# Altium schematic sheet [06]-DDR2_INTERFACE.SchDoc
size A4
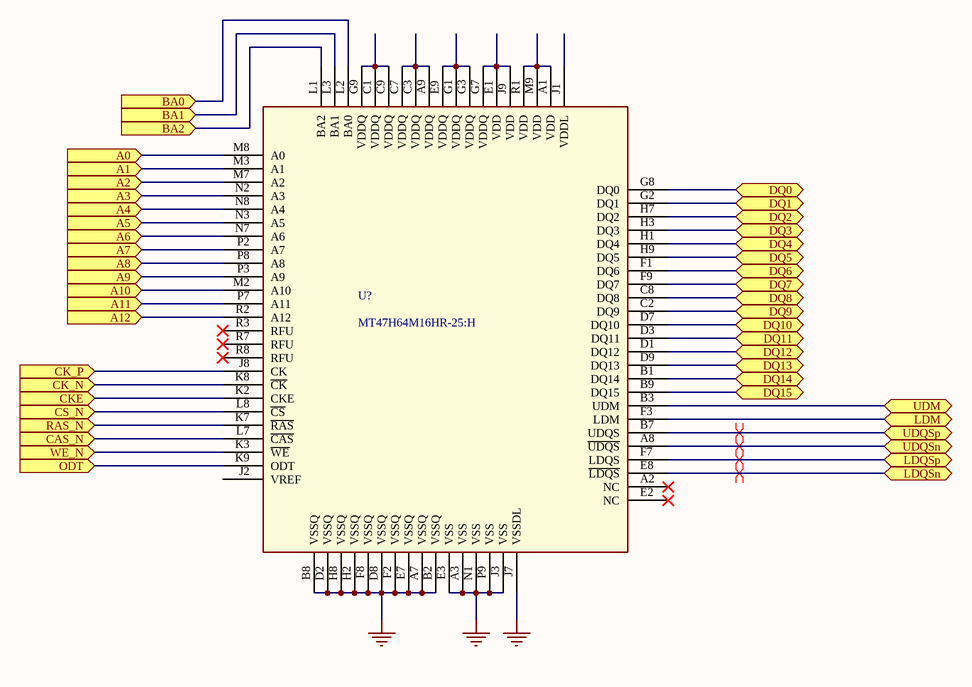
[diagram p0: [06]-DDR2_INTERFACE.SchDoc]

## Parts
U?  MT47H64M16HR-25:H  [BGA84CP80_15X9_1250X900X120B45N]

## Ports
A0 (in), A1 (in), A2 (in), A3 (in), A4 (in), A5 (in), A6 (in), A7 (in), A8 (in), A9 (in), A10 (in), A11 (in), A12 (in), BA0 (in), BA1 (in), BA2 (in), CAS_N (in), CK_N (in), CK_P (in), CKE (in), CS_N (in), DQ0, DQ1, DQ2, DQ3, DQ4, DQ5, DQ6, DQ7, DQ8, DQ9, DQ10, DQ11, DQ12, DQ13, DQ14, DQ15, LDM, LDQSn, LDQSp, ODT (in), RAS_N (in), UDM, UDQSn, UDQSp, WE_N (in)

## Nets
GND: U?.A3(VSS) U?.A7(VSSQ) U?.B2(VSSQ) U?.B8(VSSQ) U?.D2(VSSQ) U?.D8(VSSQ) U?.E3(VSS) U?.E7(VSSQ) U?.F2(VSSQ) U?.F8(VSSQ) U?.H2(VSSQ) U?.H8(VSSQ) U?.J3(VSS) U?.J7(VSSDL) U?.N1(VSS) U?.P9(VSS)
A0: U?.M8(A0) ; port A0
A1: U?.M3(A1) ; port A1
A2: U?.M7(A2) ; port A2
A3: U?.N2(A3) ; port A3
A4: U?.N8(A4) ; port A4
A5: U?.N3(A5) ; port A5
A6: U?.N7(A6) ; port A6
A7: U?.P2(A7) ; port A7
A8: U?.P8(A8) ; port A8
A9: U?.P3(A9) ; port A9
A10: U?.M2(A10) ; port A10
A11: U?.P7(A11) ; port A11
A12: U?.R2(A12) ; port A12
BA0: U?.L2(BA0) ; port BA0
BA1: U?.L3(BA1) ; port BA1
BA2: U?.L1(BA2) ; port BA2
CAS_N: U?.L7(~{CAS}) ; port CAS_N
CK_N: U?.K8(~{CK}) ; port CK_N
CK_P: U?.J8(CK) ; port CK_P
CKE: U?.K2(CKE) ; port CKE
CS_N: U?.L8(~{CS}) ; port CS_N
DQ0: U?.G8(DQ0) ; port DQ0
DQ1: U?.G2(DQ1) ; port DQ1
DQ2: U?.H7(DQ2) ; port DQ2
DQ3: U?.H3(DQ3) ; port DQ3
DQ4: U?.H1(DQ4) ; port DQ4
DQ5: U?.H9(DQ5) ; port DQ5
DQ6: U?.F1(DQ6) ; port DQ6
DQ7: U?.F9(DQ7) ; port DQ7
DQ8: U?.C8(DQ8) ; port DQ8
DQ9: U?.C2(DQ9) ; port DQ9
DQ10: U?.D7(DQ10) ; port DQ10
DQ11: U?.D3(DQ11) ; port DQ11
DQ12: U?.D1(DQ12) ; port DQ12
DQ13: U?.D9(DQ13) ; port DQ13
DQ14: U?.B1(DQ14) ; port DQ14
DQ15: U?.B9(DQ15) ; port DQ15
LDM: U?.F3(LDM) ; port LDM
LDQSn: U?.E8(~{LDQS}) ; port LDQSn
LDQSp: U?.F7(LDQS) ; port LDQSp
ODT: U?.K9(ODT) ; port ODT
RAS_N: U?.K7(~{RAS}) ; port RAS_N
UDM: U?.B3(UDM) ; port UDM
UDQSn: U?.A8(~{UDQS}) ; port UDQSn
UDQSp: U?.B7(UDQS) ; port UDQSp
WE_N: U?.K3(~{WE}) ; port WE_N
NetU?_A1: U?.A1(VDD) U?.M9(VDD) U?.R1(VDD)
NetU?_A9: U?.A9(VDDQ) U?.C3(VDDQ) U?.C7(VDDQ)
NetU?_C1: U?.C1(VDDQ) U?.C9(VDDQ) U?.G9(VDDQ)
NetU?_E1: U?.E1(VDD) U?.G7(VDDQ) U?.J9(VDD)
NetU?_E9: U?.E9(VDDQ) U?.G1(VDDQ) U?.G3(VDDQ)

Not connected (* = marked no-connect by the designer): U? A2(NC)* E2(NC)* J1(VDDL) J2(VREF) R3(RFU)* R7(RFU)* R8(RFU)*

## Layout directives
differential pair: LDQSn, LDQSp, UDQSn, UDQSp

## Library data of the parts
U? = micron_ddr2_sdram: DDR2 SDRAM with configuration of 64 Meg * 16 bits.; Designer: Faheem Minhas; Company: PhasePhotonics; 3D model: 3D contenental; PCB model: snapEDA; PCB package type: FBGA; Date Created: 18-Janruary-2019; Data Sheet URL: static6.arrow.com/aropdfconversion/e8a5cdd149c7439f33fcdfacad6c2c34fc62263c/mt47h64m16hr-25it.pdf; Byer URL: https://www.arrow.com/en/products/mt47h64m16hr-25h/micron-technology; Last Modified: 31/01/2019